# Altium project BALL-E-Main.PrjPCB
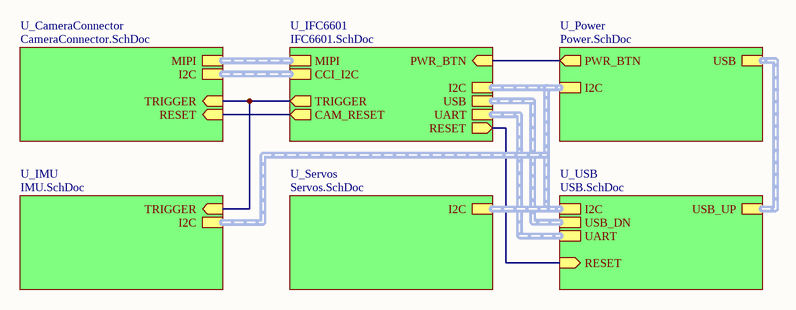
[diagram p0: BALL-E-Main.SchDoc]
7 sheets, 125 parts. Net scope: hierarchical (ports join the sheet entries above them; power ports are global).
Board file: BALL-E-Main.PcbDoc
Sheets:
  BALL-E-Main.SchDoc
    U_IFC6601 = IFC6601.SchDoc
    U_CameraConnector = CameraConnector.SchDoc
    U_IMU = IMU.SchDoc
    U_Power = Power.SchDoc
    U_Servos = Servos.SchDoc
    U_USB = USB.SchDoc

## Sheet BALL-E-Main.SchDoc
size A

### Sub-sheets
U_CameraConnector = CameraConnector.SchDoc: I2C (harness I2C), TRIGGER (in), RESET (in), MIPI (harness MIPI)
U_IFC6601 = IFC6601.SchDoc: PWR_BTN (in), UART (harness UART), USB (harness USB), I2C (harness I2C), CCI_I2C (harness I2C), RESET (out), CAM_RESET (out), TRIGGER (out), MIPI (harness MIPI)
U_IMU = IMU.SchDoc: I2C (harness I2C), TRIGGER (in)
U_Power = Power.SchDoc: I2C (harness I2C), USB (harness USB), PWR_BTN (out)
U_Servos = Servos.SchDoc: I2C (harness I2C)
U_USB = USB.SchDoc: RESET (in), USB_DN (harness USB), UART (harness UART), USB_UP (harness USB), I2C (harness I2C)

### Nets
RESET: sheet U_IFC6601/RESET, sheet U_USB/RESET
NetJP1_9: sheet U_IFC6601/TRIGGER, sheet U_CameraConnector/TRIGGER, sheet U_IMU/TRIGGER
NetJP1_10: sheet U_IFC6601/CAM_RESET, sheet U_CameraConnector/RESET
NetJP15_89: sheet U_IFC6601/PWR_BTN, sheet U_Power/PWR_BTN

### Buses and harness runs
harness sheet U_CameraConnector/I2C = sheet U_IFC6601/CCI_I2C
harness sheet U_CameraConnector/MIPI = sheet U_IFC6601/MIPI
harness sheet U_IFC6601/I2C = sheet U_IMU/I2C = sheet U_Power/I2C = sheet U_Servos/I2C = sheet U_USB/I2C
harness sheet U_IFC6601/UART = sheet U_USB/UART
harness sheet U_IFC6601/USB = sheet U_USB/USB_DN
harness sheet U_Power/USB = sheet U_USB/USB_UP

## Sheet IFC6601.SchDoc
size A
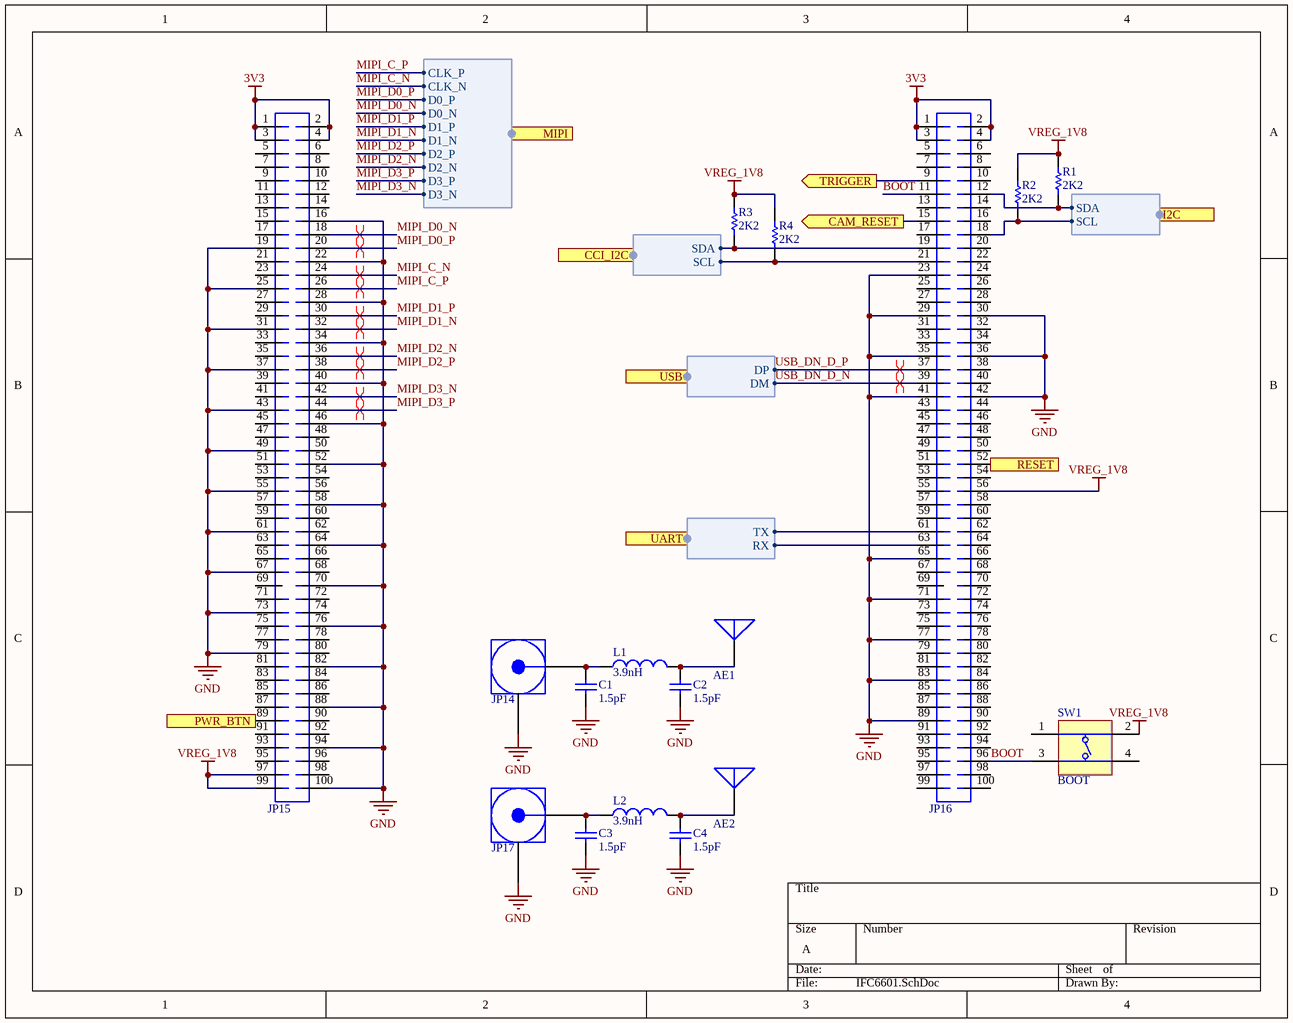
[diagram p1: IFC6601.SchDoc]

### Parts
(Parts that share a designator on the sheet are numbered #1, #2 ... from top to bottom, then left to right.)
AE1  2450AT42A100E  [ANTENNA (3.2x1.6MM)]  (value not drawn)
AE2  2450AT42A100E  [ANTENNA (3.2x1.6MM)]  (value not drawn)
C1  value 1.5pF  [C0402[1005X55]]  (hidden comment: 1.5pF 50V 0402)
C2  value 1.5pF  [C0402[1005X55]]  (hidden comment: 1.5pF 50V 0402)
C3  value 1.5pF  [C0402[1005X55]]  (hidden comment: 1.5pF 50V 0402)
C4  value 1.5pF  [C0402[1005X55]]  (hidden comment: 1.5pF 50V 0402)
JP14  MM4829-2702RB0  [COAX-HSC]  (value not drawn)
JP15  SAMTEC_SS4_100_RECEPTACLE  [SAMTEC-SS4-100-RECEPTACLE]  (value not drawn)
JP16  SAMTEC_SS4_100_RECEPTACLE  [SAMTEC-SS4-100-RECEPTACLE]  (value not drawn)
JP17  MM4829-2702RB0  [COAX-HSC]  (value not drawn)
L1  3.9nH  [IND0402]
L2  3.9nH  [IND0402]
R1  value 2K2  [R0402[1005]]  (hidden comment: 2K2 1% 0402)
R2  value 2K2  [R0402[1005]]  (hidden comment: 2K2 1% 0402)
R3  value 2K2  [R0402[1005]]  (hidden comment: 2K2 1% 0402)
R4  value 2K2  [R0402[1005]]  (hidden comment: 2K2 1% 0402)
SW1#1  BOOT  [SWITCH2]

### Ports
CAM_RESET (out), CCI_I2C (harness I2C), I2C (harness I2C), MIPI (harness MIPI), PWR_BTN (in), RESET (out), TRIGGER (out), UART (harness UART), USB (harness USB)

### Harnesses
UART: TX, RX
USB: DM, DP
I2C: SCL, SDA
MIPI: CLK_P, CLK_N, D0_P, D0_N, D1_P, D1_N, D2_P, D3_N, D2_N, D3_P

### Nets
3V3: JP15.1 JP15.2 JP15.3 JP15.4 JP16.1 JP16.2 JP16.3 JP16.4
GND: C1.1 C2.1 C3.1 C4.1 JP14.2 JP15.16 JP15.19 JP15.22 JP15.25 JP15.28 JP15.31 JP15.34 JP15.37 JP15.40 JP15.43 JP15.46 JP15.49 JP15.52 JP15.55 JP15.58 JP15.61 JP15.64 JP15.67 JP15.70 JP15.73 JP15.76 JP15.79 JP15.82 JP15.88 JP15.94 JP15.100 JP16.23 JP16.29 JP16.30 JP16.35 JP16.36 JP16.41 JP16.42 JP16.65 JP16.71 JP16.77 JP16.83 JP16.89 JP17.2
VREG_1V8: JP15.97 JP15.99 JP16.56 R1.2 R2.2 R3.2 R4.2 SW1#1.2(T2)
BOOT: JP16.11 JP16.96 SW1#1.3(T3)
I2C_SCL: JP16.18 R2.1 ; port I2C.SCL
I2C_SDA: JP16.12 R1.1 ; port I2C.SDA
MIPI_C_N: JP15.24 ; port MIPI.CLK_N
MIPI_C_P: JP15.26 ; port MIPI.CLK_P
MIPI_D0_N: JP15.18 ; port MIPI.D0_N
MIPI_D0_P: JP15.20 ; port MIPI.D0_P
MIPI_D1_N: JP15.32 ; port MIPI.D1_N
MIPI_D1_P: JP15.30 ; port MIPI.D1_P
MIPI_D2_N: JP15.36 ; port MIPI.D2_N
MIPI_D2_P: JP15.38 ; port MIPI.D2_P
MIPI_D3_N: JP15.42 ; port MIPI.D3_N
MIPI_D3_P: JP15.44 ; port MIPI.D3_P
RESET: JP16.52 ; port RESET
USB_DN_D_N: JP16.39 ; port USB.DM
USB_DN_D_P: JP16.37 ; port USB.DP
NetAE1_1: AE1.1 C2.2 L1.2
NetAE2_1: AE2.1 C4.2 L2.2
NetC1_2: C1.2 JP14.1 L1.1
NetC3_2: C3.2 JP17.1 L2.1
NetJP1_7: JP16.19 R3.1 ; port CCI_I2C.SDA
NetJP1_8: JP16.21 R4.1 ; port CCI_I2C.SCL
NetJP1_9: JP16.9 ; port TRIGGER
NetJP1_10: JP16.15 ; port CAM_RESET
NetJP15_89: JP15.89 ; port PWR_BTN
NetJP16_61: JP16.61 ; port UART.TX
NetJP16_63: JP16.63 ; port UART.RX

Not connected (* = marked no-connect by the designer): JP15 5(3) 6(4) 7(4) 8(5) 9(5) 10(6) 11(6) 12(7) 13(7) 14(8) 15(8) 17(9) 21(11) 23(12) 27(14) 29(15) 33(17) 35(18) 39(20) 41(21) 45(23) 47(24) 48(25) 50(26) 51(26) 53(27) 54(28) 56(29) 57(29) 59(30) 60(31) 62(32) 63(32) 65(33) 66(34) 68(35) 69(35) 71(36) 72(37) 74(38) 75(38) 77(39) 78(40) 80(41) 81(41) 83(42) 84(43) 85(43) 86(44) 87(44) 90(46) 91(46) 92(47) 93(47) 95(48) 96(49) 98(50); JP16 5(3) 6(4) 7(4) 8(5) 10(6) 13(7) 14(8) 16(9) 17(9) 20(11) 22(12) 24(13) 25(13) 26(14) 27(14) 28(15) 31(16) 32(17) 33(17) 34(18) 38(20) 40(21) 43(22) 44(23) 45(23) 46(24) 47(24) 48(25) 49(25) 50(26) 51(26) 53(27) 54(28) 55(28) 57(29) 58(30) 59(30) 60(31) 62(32) 64(33) 66(34) 67(34) 68(35) 69(35) 70(36) 72(37) 73(37) 74(38) 75(38) 76(39) 78(40) 79(40) 80(41) 81(41) 82(42) 84(43) 85(43) 86(44) 87(44) 88(45) 90(46) 91(46) 92(47) 93(47) 94(48) 95(48) 97(49) 98(50) 99(50) 100(51); SW1#1 1(T1) 4(T3)

### Layout directives
differential pair: MIPI_C_N, MIPI_C_P, MIPI_D0_N, MIPI_D0_P, MIPI_D1_N, MIPI_D1_P, MIPI_D2_N, MIPI_D2_P, MIPI_D3_N, MIPI_D3_P, USB_DN_D_N, USB_DN_D_P

### Library data of the parts
AE1 AE2 = 2450AT42A100E: Manufacturer: Johanson Technology Inc.; PartNumber: 2450AT42A100E; Mounting Technology: Surface Mount
C1-C4 = CAP_1.5pF_50V_0402_0.05pF: 1.5pF 50V 0.05pF 0402 (1005 Metric); PartNumber: GRM1555C1H1R5WA01D; Manufacturer: Murata; Mounting Technology: Surface Mount; PackageReference: 0402; PackageDescription: 0402 (1005 Metric); Voltage: 50V; Tolerance: 0.05pF
JP14 JP17 = MM4829-2702RB0: CONN HSC RCPT STR 50 OHM SMD; Manufacturer: Murata; PackageReference: HSC; PartNumber: MM4829-2702RB0; Mounting Technology: Surface Mount
JP15 JP16 = SAMTEC_SS4_100_RECEPTACLE: Manufacturer: Samtec; PartNumber: SS4-50-3.00-L-D-K-TR; PackageReference: SS4-100; Mounting Technology: Surface Mount
L1 L2 = IND_3.9nH_0.3A_0402_0.3nH: 3.9nH +/-0.3nH 0.3A 0402; PartNumber: LQG15HS3N9S02D; Manufacturer: Murata; PackageReference: 0402; PackageDescription: 0402 (2012 metric); Mounting Technology: Surface Mount; Current: 0.3A; Value: 3.9nH
R1-R4 = RES_2K2_0402_1%: 2K2 0.063W 1% 0402 (1005 Metric); Manufacturer: KOA Speer; PartNumber: RK73H1ETTP2201F; Tolerance: 1%; Power: 0.063W; Mounting Technology: Surface Mount; PackageReference: 0402; PackageDescription: 0402 (1005 Metric); ComponentLink1Description: Datasheet; ComponentLink1URL: http://www.koaspeer.com/catimages/Products/RK73H/RK73H.pdf
SW1#1 = DIPT-DTSM-6: Switch, SPNO Push Button SMD; Manufacturer: C&K Components; PartNumber: PTS810 SJM 250 SMTR LFS; Packing Type: Tape&Reel; Mechanical Life: 200,000 cycles; ComponentLink2URL: http://www.dip.com.tw/Products_tact.htm; ComponentLink1URL: http://www.dip.com.tw/; ComponentLink3URL: http://www.dip.com.tw/PDF/pro_tact/DTSM_G_-6_2_-V.pdf; PackageDescription: Switch, Surface Mount, 4 Leads, Body 4.6x2.8mm, Height 1.9mm; ComponentLink2Description: Datasheet; ComponentLink3Description: Package Specification; ComponentLink1Description: Manufacturer URL; PackageReference: PTS810; Mounting Technology: Surface Mount

## Sheet CameraConnector.SchDoc
size A
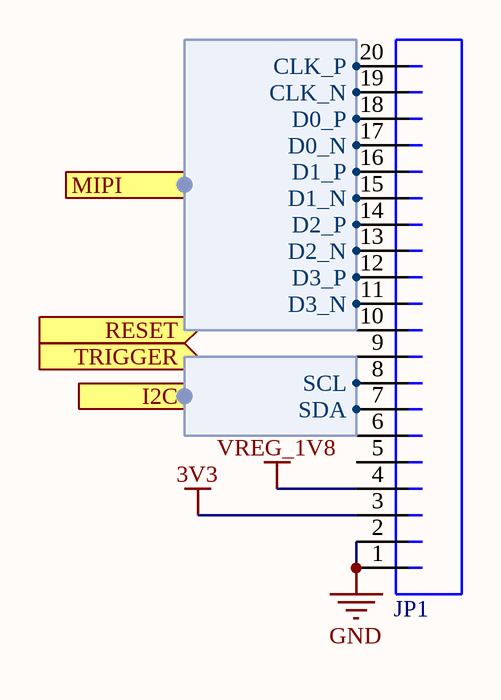
[diagram p2: CameraConnector.SchDoc]

### Parts
JP1  JST_JMD_20_HORZ  [JST-JMD-20-SMD-HORZ]  (value not drawn)

### Ports
I2C (harness I2C), MIPI (harness MIPI), RESET (in), TRIGGER (in)

### Harnesses
I2C: SCL, SDA
MIPI: CLK_P, CLK_N, D0_P, D0_N, D1_P, D1_N, D2_P, D3_N, D2_N, D3_P

### Nets
3V3: JP1.3
GND: JP1.1 JP1.2
VREG_1V8: JP1.4
MIPI_C_N: JP1.19 ; port MIPI.CLK_N
MIPI_C_P: JP1.20 ; port MIPI.CLK_P
MIPI_D0_N: JP1.17 ; port MIPI.D0_N
MIPI_D0_P: JP1.18 ; port MIPI.D0_P
MIPI_D1_N: JP1.15 ; port MIPI.D1_N
MIPI_D1_P: JP1.16 ; port MIPI.D1_P
MIPI_D2_N: JP1.13 ; port MIPI.D2_N
MIPI_D2_P: JP1.14 ; port MIPI.D2_P
MIPI_D3_N: JP1.11 ; port MIPI.D3_N
MIPI_D3_P: JP1.12 ; port MIPI.D3_P
NetJP1_7: JP1.7 ; port I2C.SDA
NetJP1_8: JP1.8 ; port I2C.SCL
NetJP1_9: JP1.9 ; port TRIGGER
NetJP1_10: JP1.10 ; port RESET

Not connected (* = marked no-connect by the designer): JP1 5 6

### Library data of the parts
JP1 = JST_JMD_20_HORZ: Manufacturer: JST Sales America, Inc.; PartNumber: 20PS-JMDSS-G-1-TF; PackageReference: JMD-20; Mounting Technology: Surface Mount

## Sheet IMU.SchDoc
size A
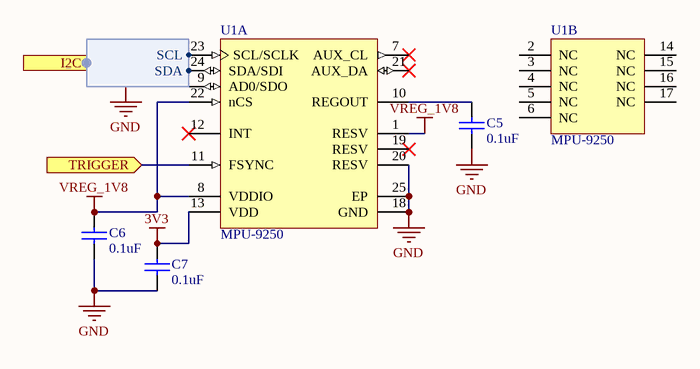
[diagram p3: IMU.SchDoc]

### Parts
C5  value 0.1uF  [C0402[1005X55]]  (hidden comment: 0.1uF 6.3V 0402)
C6  value 0.1uF  [C0402[1005X55]]  (hidden comment: 0.1uF 6.3V 0402)
C7  value 0.1uF  [C0402[1005X55]]  (hidden comment: 0.1uF 6.3V 0402)
U1  MPU-9250  [QFN-24 (0.4MM)]  (parts A,B of 2)

### Ports
I2C (harness I2C), TRIGGER (in)

### Harnesses
I2C: SCL, SDA

### Nets
3V3: C7.2 U1.13(VDD)
GND: C5.1 C6.1 C7.1 U1.9(AD0/SDO) U1.18(GND) U1.20(RESV) U1.25(EP)
VREG_1V8: C6.2 U1.1(RESV) U1.8(VDDIO) U1.22(nCS)
I2C_SCL: U1.23(SCL/SCLK) ; port I2C.SCL
I2C_SDA: U1.24(SDA/SDI) ; port I2C.SDA
NetC5_2: C5.2 U1.10(REGOUT)
NetJP1_9: U1.11(FSYNC) ; port TRIGGER

Not connected (* = marked no-connect by the designer): U1 2(NC) 3(NC) 4(NC) 5(NC) 6(NC) 7(AUX_CL)* 12(INT)* 14(NC) 15(NC) 16(NC) 17(NC) 19(RESV)* 21(AUX_DA)*

### Library data of the parts
C5-C7 = CAP_0.1uF_6.3V_0402_10%: 0.1uF 6.3V 10% 0402 (1005 Metric); PartNumber: GRM155R70J104KA01D; Manufacturer: Murata; Mounting Technology: Surface Mount; PackageReference: 0402; PackageDescription: 0402 (1005 Metric); Voltage: 6.3V; Tolerance: 10%
U1 = MPU-9250: Manufacturer: Invensense; PartNumber: MPU-9250; Mounting Technology: Surface Mount; PackageReference: QFN-24

## Sheet Power.SchDoc
size A
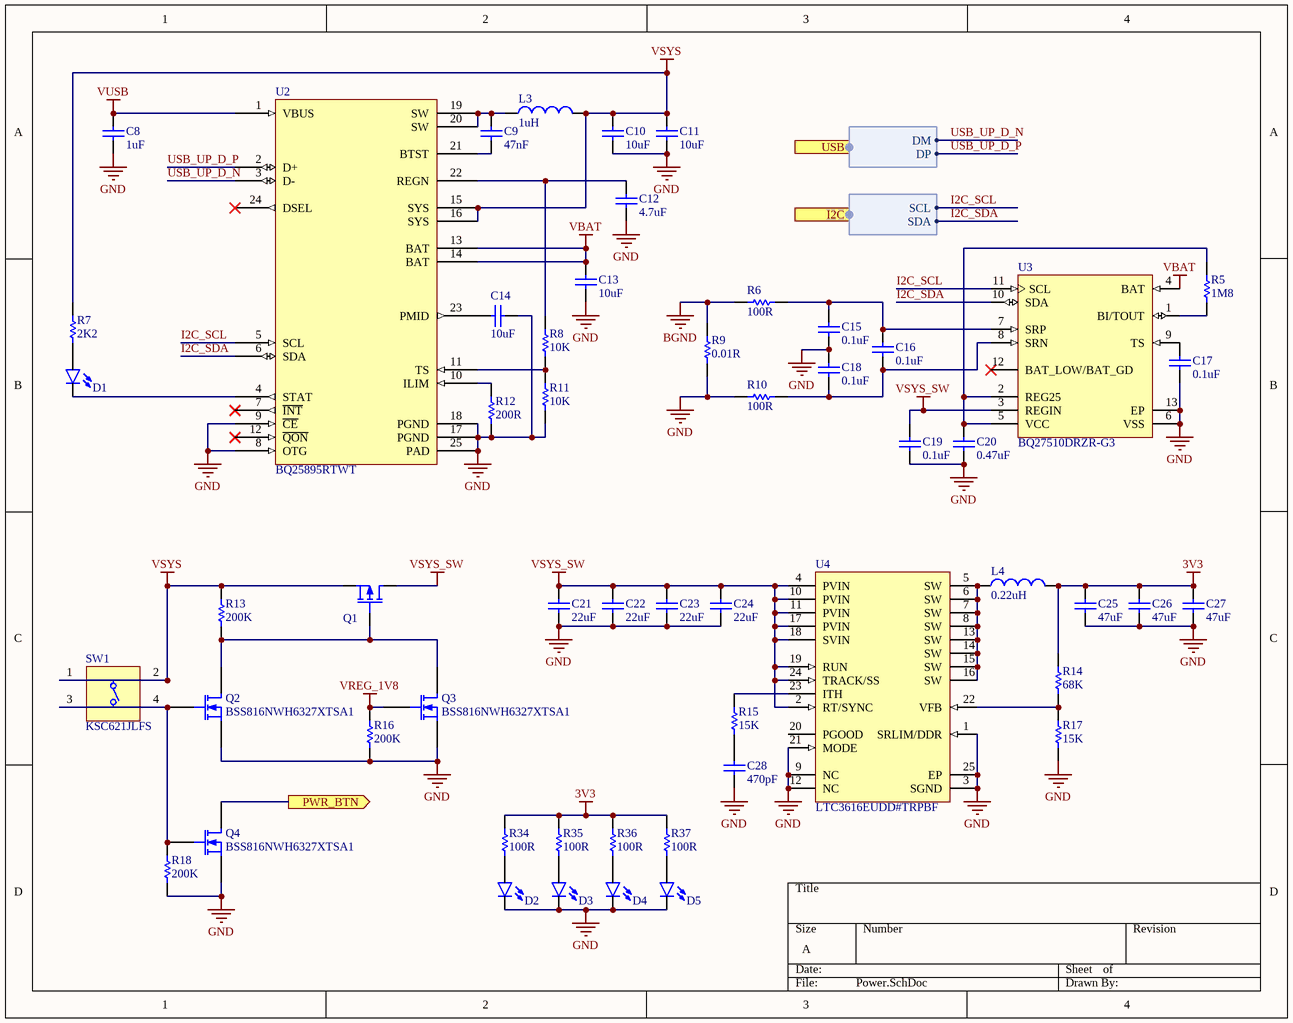
[diagram p4: Power.SchDoc]

### Parts
(Parts that share a designator on the sheet are numbered #1, #2 ... from top to bottom, then left to right.)
C8  value 1uF  [C0402[1005X55]]  (hidden comment: 1uF 16V 0402)
C9  value 47nF  [C0402[1005X55]]  (hidden comment: 47nF 16V 0402)
C10  value 10uF  [C0402[1005X55]]  (hidden comment: 10uF 6.3V 0402)
C11  value 10uF  [C0402[1005X55]]  (hidden comment: 10uF 6.3V 0402)
C12  value 4.7uF  [C0402[1005X55]]  (hidden comment: 4.7uF 10V 0402)
C13  value 10uF  [C0402[1005X55]]  (hidden comment: 10uF 6.3V 0402)
C14  value 10uF  [C0603[1608X92]]  (hidden comment: 10uF 35V 0603)
C15  value 0.1uF  [C0402[1005X55]]  (hidden comment: 0.1uF 6.3V 0402)
C16  value 0.1uF  [C0402[1005X55]]  (hidden comment: 0.1uF 6.3V 0402)
C17  value 0.1uF  [C0402[1005X55]]  (hidden comment: 0.1uF 6.3V 0402)
C18  value 0.1uF  [C0402[1005X55]]  (hidden comment: 0.1uF 6.3V 0402)
C19  value 0.1uF  [C0402[1005X55]]  (hidden comment: 0.1uF 6.3V 0402)
C20  value 0.47uF  [C0402[1005X55]]  (hidden comment: 0.47uF 25V 0402)
C21  value 22uF  [C0603[1608X92]]  (hidden comment: 22uF 6.3V 0603)
C22  value 22uF  [C0603[1608X92]]  (hidden comment: 22uF 6.3V 0603)
C23  value 22uF  [C0603[1608X92]]  (hidden comment: 22uF 6.3V 0603)
C24  value 22uF  [C0603[1608X92]]  (hidden comment: 22uF 6.3V 0603)
C25  value 47uF  [C1206[3216X160]]  (hidden comment: 47uF 6.3V 1206)
C26  value 47uF  [C1206[3216X160]]  (hidden comment: 47uF 6.3V 1206)
C27  value 47uF  [C1206[3216X160]]  (hidden comment: 47uF 6.3V 1206)
C28  value 470pF  [C0402[1005X55]]  (hidden comment: 470pF 50V 0402)
D1  LED_0603_GREEN_5mA  [LED0603]  (value not drawn)
D2  LED_0603_BLUE_5mA  [LED0603]  (value not drawn)
D3  LED_0603_BLUE_5mA  [LED0603]  (value not drawn)
D4  LED_0603_BLUE_5mA  [LED0603]  (value not drawn)
D5  LED_0603_BLUE_5mA  [LED0603]  (value not drawn)
L3  1uH  [IND1008]
L4  0.22uH  [IND1008]
Q1  SIS407DN-T1-GE3  [PowerPak-1212-8]  (value not drawn)
Q2  BSS816NWH6327XTSA1  [SOT323-3]
Q3  BSS816NWH6327XTSA1  [SOT323-3]
Q4  BSS816NWH6327XTSA1  [SOT323-3]
R5  value 1M8  [R0402[1005]]  (hidden comment: 1M8 1% 0402)
R6  value 100R  [R0402[1005]]  (hidden comment: 100R 1% 0402)
R7  value 2K2  [R0402[1005]]  (hidden comment: 2K2 1% 0402)
R8  value 10K  [R0402[1005]]  (hidden comment: 10K 1% 0402)
R9  value 0.01R  [R1206[3216]]  (hidden comment: 0.01R 1% 1206)
R10  value 100R  [R0402[1005]]  (hidden comment: 100R 1% 0402)
R11  value 10K  [R0402[1005]]  (hidden comment: 10K 1% 0402)
R12  value 200R  [R0402[1005]]  (hidden comment: 200R 1% 0402)
R13  value 200K  [R0402[1005]]  (hidden comment: 200K 1% 0402)
R14  value 68K  [R0402[1005]]  (hidden comment: 68K 1% 0402)
R15  value 15K  [R0402[1005]]  (hidden comment: 15K 1% 0402)
R16  value 200K  [R0402[1005]]  (hidden comment: 200K 1% 0402)
R17  value 15K  [R0402[1005]]  (hidden comment: 15K 1% 0402)
R18  value 200K  [R0402[1005]]  (hidden comment: 200K 1% 0402)
R34  value 100R  [R0402[1005]]  (hidden comment: 100R 1% 0402)
R35  value 100R  [R0402[1005]]  (hidden comment: 100R 1% 0402)
R36  value 100R  [R0402[1005]]  (hidden comment: 100R 1% 0402)
R37  value 100R  [R0402[1005]]  (hidden comment: 100R 1% 0402)
SW1#2  KSC621JLFS  [SWITCH]
U2  BQ25895RTWT  [WQFN-24]
U3  BQ27510DRZR-G3  [VSON-12]
U4  LTC3616EUDD#TRPBF  [LT-UDD-24_L]

### Ports
I2C (harness I2C), PWR_BTN (out), USB (harness USB)

### Harnesses
I2C: SCL, SDA
USB: DM, DP

### Nets
3V3: C25.2 C26.2 C27.2 L4.2 R14.2 R34.1 R35.1 R36.1 R37.1
BGND: R6.1 R9.2
GND: C8.1 C10.1 C11.1 C12.1 C13.1 C14.1 C15.1 C17.1 C18.2 C19.1 C20.1 C21.1 C22.1 C23.1 C24.1 C25.1 C26.1 C27.1 C28.1 D2.C D3.C D4.C D5.C Q2.2(S) Q3.2(S) Q4.2(S) R9.1 R10.1 R11.1 R12.1 R16.1 R17.1 R18.1 U2.8(OTG) U2.9(~{CE}) U2.17(PGND) U2.18(PGND) U2.25(PAD) U3.6(VSS) U3.13(EP) U4.1(SRLIM/DDR) U4.3(SGND) U4.9(NC) U4.12(NC) U4.21(MODE) U4.25(EP)
VBAT: C13.2 U2.13(BAT) U2.14(BAT) U3.4(BAT)
VREG_1V8: Q3.1(G) R16.2
VSYS: C10.2 C11.2 L3.2 Q1.1(S) R7.2 R13.2 SW1#2.1(T1) SW1#2.2(T2) U2.15(SYS) U2.16(SYS)
VSYS_SW: C19.2 C21.2 C22.2 C23.2 C24.2 Q1.3(D) U3.3(REGIN) U4.2(RT/SYNC) U4.4(PVIN) U4.10(PVIN) U4.11(PVIN) U4.17(PVIN) U4.18(SVIN) U4.19(RUN) U4.24(TRACK/SS)
VUSB: C8.2 U2.1(VBUS)
I2C_SCL: U2.5(SCL) U3.11(SCL) ; port I2C.SCL
I2C_SDA: U2.6(SDA) U3.10(SDA) ; port I2C.SDA
USB_UP_D_N: U2.3(D-) ; port USB.DM
USB_UP_D_P: U2.2(D+) ; port USB.DP
NetC9_1: C9.1 U2.21(BTST)
NetC9_2: C9.2 L3.1 U2.19(SW) U2.20(SW)
NetC12_2: C12.2 R8.2 U2.22(REGN)
NetC14_2: C14.2 U2.23(PMID)
NetC15_2: C15.2 C16.2 R6.2 U3.7(SRP)
NetC16_1: C16.1 C18.1 R10.2 U3.8(SRN)
NetC17_2: C17.2 U3.9(TS)
NetC20_2: C20.2 R5.2 U3.2(REG25) U3.5(VCC)
NetC28_2: C28.2 R15.1
NetD1_A: D1.A R7.1
NetD1_C: D1.C U2.4(STAT)
NetD2_A: D2.A R34.2
NetD3_A: D3.A R35.2
NetD4_A: D4.A R36.2
NetD5_A: D5.A R37.2
NetJP15_89: Q4.3(D) ; port PWR_BTN
NetL4_1: L4.1 U4.5(SW) U4.6(SW) U4.7(SW) U4.8(SW) U4.13(SW) U4.14(SW) U4.15(SW) U4.16(SW)
NetQ1_2: Q1.2(G) Q2.3(D) Q3.3(D) R13.1
NetQ2_1: Q2.1(G) Q4.1(G) R18.2 SW1#2.3(T3) SW1#2.4(T3)
NetR5_1: R5.1 U3.1(BI/TOUT)
NetR8_1: R8.1 R11.2 U2.11(TS)
NetR12_2: R12.2 U2.10(ILIM)
NetR14_1: R14.1 R17.2 U4.22(VFB)
NetR15_2: R15.2 U4.23(ITH)

Not connected (* = marked no-connect by the designer): U2 7(~{INT})* 12(~{QON})* 24(DSEL)*; U3 12(BAT_LOW/BAT_GD)*; U4 20(PGOOD)

### Library data of the parts
C8 = CAP_1uF_16V_0402_10%: 1uF 16V 10% 0402 (1005 Metric); PartNumber: GRM155R61C105KE01D; Manufacturer: Murata; Mounting Technology: Surface Mount; PackageReference: 0402; PackageDescription: 0402 (1005 Metric); Voltage: 16V; Tolerance: 10%
C9 = CAP_47nF_16V_0402_10%: 47nF 16V 10% 0402 (1005 Metric); PartNumber: GCM155R71C473KA37D; Manufacturer: Murata; Mounting Technology: Surface Mount; PackageReference: 0402; PackageDescription: 0402 (1005 Metric); Voltage: 16V; Tolerance: 10%
C10 C11 C13 = CAP_10uF_6.3V_0402_20%: 10uF 6.3V 20% 0402 (1005 Metric); PartNumber: GRM155R60J106ME44D; Manufacturer: Murata; Mounting Technology: Surface Mount; PackageReference: 0402; PackageDescription: 0402 (1005 Metric); Voltage: 6.3V; Tolerance: 20%
C12 = CAP_4.7uF_10V_0402_10%: 4.7uF 10V 10% 0402 (1005 Metric); PartNumber: ZRB15XR61A475KE01D; Manufacturer: Murata; Mounting Technology: Surface Mount; PackageReference: 0402; PackageDescription: 0402 (1005 Metric); Voltage: 10V; Tolerance: 10%
C14 = CAP_10uF_35V_0603_10%: 10uF 35V 10% 0603 (1608 Metric); PartNumber: GRM188R6YA106MA73D; Manufacturer: Murata; Mounting Technology: Surface Mount; PackageReference: 0603; PackageDescription: 0603 (1608 Metric); Voltage: 35V; Tolerance: 10%
C15-C19 = CAP_0.1uF_6.3V_0402_10%: as C5 on sheet IMU; Mounting Technology: Surface Mount; PackageReference: 0402; PackageDescription: 0402 (1005 Metric); Voltage: 6.3V; Tolerance: 10%
C20 = CAP_0.47uF_25V_0402_10%: 0.47uF 25V 10% 0402 (1005 Metric); PartNumber: GRM155R61E474KE01D; Manufacturer: Murata; Mounting Technology: Surface Mount; PackageReference: 0402; PackageDescription: 0402 (1005 Metric); Voltage: 25V; Tolerance: 10%
C21-C24 = CAP_22uF_6.3V_0603_10%: 22uF 6.3V 10% 0603 (1608 Metric); PartNumber: GRT188R60J226ME13D; Manufacturer: Murata; Mounting Technology: Surface Mount; PackageReference: 0603; PackageDescription: 0603 (1608 Metric); Voltage: 6.3V; Tolerance: 10%
C25-C27 = CAP_47uF_6.3V_1206_10%: 47uF 6.3V 10% 1206 (3216 Metric); PartNumber: GRM31CR60J476KE19L; Manufacturer: Murata; Mounting Technology: Surface Mount; PackageReference: 1206; PackageDescription: 1206 (3216 Metric); Voltage: 6.3V; Tolerance: 10%
C28 = CAP_470pF_50V_0402_5%: 470pF 50V 5% 0402 (1005 Metric); PartNumber: GCM1555C1H471JA16D; Manufacturer: Murata; Mounting Technology: Surface Mount; PackageReference: 0402; PackageDescription: 0402 (1005 Metric); Voltage: 50V; Tolerance: 5%
D1 = LED_0603_GREEN_5mA: PartNumber: LTST-C193TGKT-5A; Manufacturer: Lite-On Inc.; PackageReference: 0603; PackageDescription: 0603 (1608 Metric); Mounting Technology: Surface Mount
D2-D5 = LED_0603_BLUE_5mA: PartNumber: LTST-C193TBKT-5A; Manufacturer: Lite-On Inc.; PackageReference: 0603; PackageDescription: 0603 (1608 Metric); Mounting Technology: Surface Mount
L3 = IND_1uH_4.7A_1008_20%: 1uH 20% 4.7A 1008; PartNumber: DFE252012F-2R2M=P2; Manufacturer: Murata; PackageReference: 1008; PackageDescription: 1008 (2520 metric); Mounting Technology: Surface Mount; Current: 4.7A; Value: 1uH
L4 = IND_0.22uH_6.7A_1008_20%: 0.22uH 20% 6.7A 1008; PartNumber: TFM252012ALMAR22MTAA; Manufacturer: Murata; PackageReference: 1008; PackageDescription: 1008 (2520 metric); Mounting Technology: Surface Mount; Current: 6.7A; Value: 0.22uH
Q1 = SIS407DN-T1-GE3: P-Channel MOSFET; Manufacturer: Vishay; PartNumber: SIS407DN-T1-GE3; Mounting Technology: Surface Mount; PackageReference: PowerPAK-1212-8
Q2-Q4 = BSS816NWH6327XTSA1: N-Channel MOSFET; Manufacturer: Infineon Technologies; PartNumber: BSS816NWH6327XTSA1; PackageReference: SOT-323-3; Mounting Technology: Surface Mount
R5 = RES_1M8_0402_1%: 1M8 0.063W 1% 0402 (1005 Metric); Manufacturer: KOA Speer; PartNumber: RK73H1ETTP1804F; Tolerance: 1%; Power: 0.063W; Mounting Technology: Surface Mount; PackageReference: 0402; PackageDescription: 0402 (1005 Metric); ComponentLink1Description: Datasheet; ComponentLink1URL: http://www.koaspeer.com/catimages/Products/RK73H/RK73H.pdf
R6 R10 R34-R37 = RES_100R_0402_1%: 100R 0.063W 1% 0402 (1005 Metric); Manufacturer: KOA Speer; PartNumber: RK73H1ETTP1000F; Tolerance: 1%; Power: 0.063W; Mounting Technology: Surface Mount; PackageReference: 0402; PackageDescription: 0402 (1005 Metric); ComponentLink1Description: Datasheet; ComponentLink1URL: http://www.koaspeer.com/catimages/Products/RK73H/RK73H.pdf
R7 = RES_2K2_0402_1%: as R1 on sheet IFC6601; Tolerance: 1%; Power: 0.063W; Mounting Technology: Surface Mount; PackageReference: 0402; PackageDescription: 0402 (1005 Metric); ComponentLink1Description: Datasheet; ComponentLink1URL: http://www.koaspeer.com/catimages/Products/RK73H/RK73H.pdf
R8 R11 = RES_10K_0402_1%: 10K 0.063W 1% 0402 (1005 Metric); Manufacturer: KOA Speer; PartNumber: RK73H1ETTP1002F; Tolerance: 1%; Power: 0.063W; Mounting Technology: Surface Mount; PackageReference: 0402; PackageDescription: 0402 (1005 Metric); ComponentLink1Description: Datasheet; ComponentLink1URL: http://www.koaspeer.com/catimages/Products/RK73H/RK73H.pdf
R9 = RES_0.01R_1206_1%_1.5W: 0.01R 1.5W 1% 1206 (3216 Metric); Manufacturer: KOA Speer; PartNumber: TLR2BPDTD10L0F75; Tolerance: 1%; Power: 1.5W; Mounting Technology: Surface Mount; PackageReference: 1206; PackageDescription: 1206 (3216 Metric)
R12 = RES_200R_0402_1%: 200R 0.063W 1% 0402 (1005 Metric); Manufacturer: KOA Speer; PartNumber: RK73H1ETTP2000F; Tolerance: 1%; Power: 0.063W; Mounting Technology: Surface Mount; PackageReference: 0402; PackageDescription: 0402 (1005 Metric); ComponentLink1Description: Datasheet; ComponentLink1URL: http://www.koaspeer.com/catimages/Products/RK73H/RK73H.pdf
R13 R16 R18 = RES_200K_0402_1%: 200K 0.063W 1% 0402 (1005 Metric); Manufacturer: KOA Speer; PartNumber: RK73H1ETTP2003F; Tolerance: 1%; Power: 0.063W; Mounting Technology: Surface Mount; PackageReference: 0402; PackageDescription: 0402 (1005 Metric); ComponentLink1Description: Datasheet; ComponentLink1URL: http://www.koaspeer.com/catimages/Products/RK73H/RK73H.pdf
R14 = RES_68K_0402_1%: 68K 0.063W 1% 0402 (1005 Metric); Manufacturer: KOA Speer; PartNumber: RK73H1ETTP6802F; Tolerance: 1%; Power: 0.063W; Mounting Technology: Surface Mount; PackageReference: 0402; PackageDescription: 0402 (1005 Metric); ComponentLink1Description: Datasheet; ComponentLink1URL: http://www.koaspeer.com/catimages/Products/RK73H/RK73H.pdf
R15 R17 = RES_15K_0402_1%: 15K 0.063W 1% 0402 (1005 Metric); Manufacturer: KOA Speer; PartNumber: RK73H1ETTP1502F; Tolerance: 1%; Power: 0.063W; Mounting Technology: Surface Mount; PackageReference: 0402; PackageDescription: 0402 (1005 Metric); ComponentLink1Description: Datasheet; ComponentLink1URL: http://www.koaspeer.com/catimages/Products/RK73H/RK73H.pdf
SW1#2 = KSC621JLFS: Switch, SPNO Push Button SMD; Manufacturer: C&K Components; Packing Type: Tape&Reel; Mechanical Life: 200,000 cycles; ComponentLink2URL: http://www.dip.com.tw/Products_tact.htm; ComponentLink1URL: http://www.dip.com.tw/; ComponentLink3URL: http://www.dip.com.tw/PDF/pro_tact/DTSM_G_-6_2_-V.pdf; PackageDescription: Switch, Surface Mount, 4 Leads, Body 6.2x6.2mm, Height 7.7mm; ComponentLink2Description: Datasheet; ComponentLink3Description: Package Specification; ComponentLink1Description: Manufacturer URL; PackageReference: KSC; PartNumber: KSC621JLFS; Mounting Technology: Surface Mount
U2 = BQ25895RTWT: IC NVDC CHARGER I2C 24WQFN; Manufacturer: Texas Instruments; PartNumber: BQ25895RTWT; PackageReference: WQFN-24; Mounting Technology: Surface Mount
U3 = BQ27510DRZR-G3: Battery Management System-Side Impedance Track Fuel Gauge; Manufacturer: Texas Instruments; PartNumber: BQ27510DRZR-G3; PackageReference: VSON-12; Mounting Technology: Surface Mount
U4 = CMP-0492-02186-1: 6 A, 4 MHz Monolithic Synchronous Step-Down DC/DC Converter, 24-pin QFN (UDD-24), -40 to 125 degC, Pb-Free, Tape and Reel; Manufacturer: Linear Technology; Frequency Adjust Range: Up - 4MHz; Number of Outputs: 1; ComponentLink3URL: http://cds.linear.com/docs/en/packaging/(UDD24)%20QFN%2005-08-1833%20Rev%20%C3%98.pdf; PartNumber: LTC3616EUDD#TRPBF; Packing: Tape and Reel; ComponentLink1URL: http://www.linear.com/; ComponentLink2URL: http://cds.linear.com/docs/en/datasheet/3616fa.pdf; Mounting Technology: Surface Mount; ComponentLink3Description: Package Specification; PackageVersion: Rev. Ã˜, 05/2011; ComponentLink1Description: Manufacturer URL; DatasheetVersion: Rev. A; ComponentLink2Description: Datasheet; RoHS: TRUE; PackageReference: UDD-24; PackageDescription: 24-Pin Plastic QFN, Body 5 x 3 mm, Pitch 0.5 mm

## Sheet Servos.SchDoc
size A
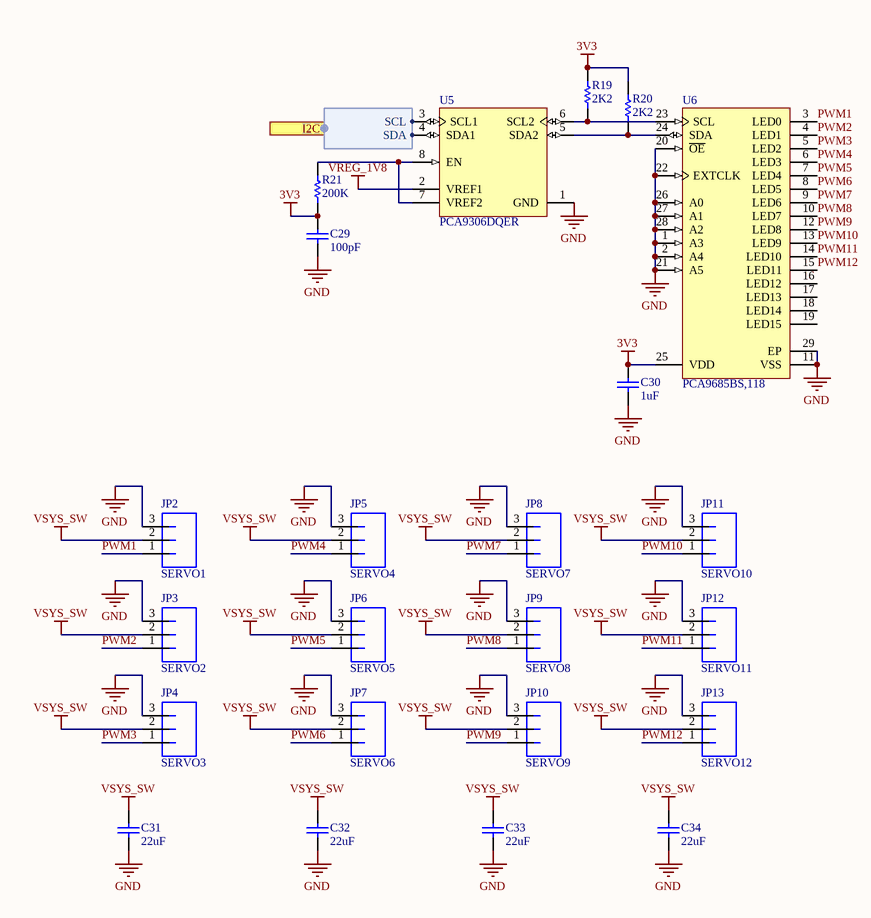
[diagram p5: Servos.SchDoc]

### Parts
C29  value 100pF  [C0402[1005X55]]  (hidden comment: 100pF 100V 0402)
C30  value 1uF  [C0402[1005X55]]  (hidden comment: 1uF 6.3V 0402)
C31  value 22uF  [C0603[1608X92]]  (hidden comment: 22uF 6.3V 0603)
C32  value 22uF  [C0603[1608X92]]  (hidden comment: 22uF 6.3V 0603)
C33  value 22uF  [C0603[1608X92]]  (hidden comment: 22uF 6.3V 0603)
C34  value 22uF  [C0603[1608X92]]  (hidden comment: 22uF 6.3V 0603)
JP2  SERVO1  [MOLEX-PICOBLADE-1.25MM-3-VERT-SMD]
JP3  SERVO2  [MOLEX-PICOBLADE-1.25MM-3-VERT-SMD]
JP4  SERVO3  [MOLEX-PICOBLADE-1.25MM-3-VERT-SMD]
JP5  SERVO4  [MOLEX-PICOBLADE-1.25MM-3-VERT-SMD]
JP6  SERVO5  [MOLEX-PICOBLADE-1.25MM-3-VERT-SMD]
JP7  SERVO6  [MOLEX-PICOBLADE-1.25MM-3-VERT-SMD]
JP8  SERVO7  [MOLEX-PICOBLADE-1.25MM-3-VERT-SMD]
JP9  SERVO8  [MOLEX-PICOBLADE-1.25MM-3-VERT-SMD]
JP10  SERVO9  [MOLEX-PICOBLADE-1.25MM-3-VERT-SMD]
JP11  SERVO10  [MOLEX-PICOBLADE-1.25MM-3-VERT-SMD]
JP12  SERVO11  [MOLEX-PICOBLADE-1.25MM-3-VERT-SMD]
JP13  SERVO12  [MOLEX-PICOBLADE-1.25MM-3-VERT-SMD]
R19  value 2K2  [R0402[1005]]  (hidden comment: 2K2 1% 0402)
R20  value 2K2  [R0402[1005]]  (hidden comment: 2K2 1% 0402)
R21  value 200K  [R0402[1005]]  (hidden comment: 200K 1% 0402)
U5  PCA9306DQER  [DQE0008A_V]
U6  PCA9685BS,118  [VQFN-28]

### Ports
I2C (harness I2C)

### Harnesses
I2C: SCL, SDA

### Nets
3V3: C29.2 C30.2 R19.2 R20.2 R21.1 U6.25(VDD)
GND: C29.1 C30.1 C31.1 C32.1 C33.1 C34.1 JP2.3 JP3.3 JP4.3 JP5.3 JP6.3 JP7.3 JP8.3 JP9.3 JP10.3 JP11.3 JP12.3 JP13.3 U5.1(GND) U6.1(A3) U6.2(A4) U6.11(VSS) U6.20(~{OE}) U6.21(A5) U6.22(EXTCLK) U6.26(A0) U6.27(A1) U6.28(A2) U6.29(EP)
VREG_1V8: U5.2(VREF1)
VSYS_SW: C31.2 C32.2 C33.2 C34.2 JP2.2 JP3.2 JP4.2 JP5.2 JP6.2 JP7.2 JP8.2 JP9.2 JP10.2 JP11.2 JP12.2 JP13.2
I2C_SCL: U5.3(SCL1) ; port I2C.SCL
I2C_SDA: U5.4(SDA1) ; port I2C.SDA
PWM1: JP2.1 U6.3(LED0)
PWM2: JP3.1 U6.4(LED1)
PWM3: JP4.1 U6.5(LED2)
PWM4: JP5.1 U6.6(LED3)
PWM5: JP6.1 U6.7(LED4)
PWM6: JP7.1 U6.8(LED5)
PWM7: JP8.1 U6.9(LED6)
PWM8: JP9.1 U6.10(LED7)
PWM9: JP10.1 U6.12(LED8)
PWM10: JP11.1 U6.13(LED9)
PWM11: JP12.1 U6.14(LED10)
PWM12: JP13.1 U6.15(LED11)
NetR19_1: R19.1 U5.6(SCL2) U6.23(SCL)
NetR20_1: R20.1 U5.5(SDA2) U6.24(SDA)
NetR21_2: R21.2 U5.7(VREF2) U5.8(EN)

Not connected (* = marked no-connect by the designer): U6 16(LED12) 17(LED13) 18(LED14) 19(LED15)

### Library data of the parts
C29 = CAP_100pF_100V_0402_5%: 100pF 100V 5% 0402 (1005 Metric); PartNumber: GRM1555C2A101JA01D; Manufacturer: Murata; Mounting Technology: Surface Mount; PackageReference: 0402; PackageDescription: 0402 (1005 Metric); Voltage: 100V; Tolerance: 5%
C30 = CAP_1uF_6.3V_0402_10%: 1uF 6.3V 10% 0402 (1005 Metric); PartNumber: GRM155R70J105KA12D; Manufacturer: Murata; Mounting Technology: Surface Mount; PackageReference: 0402; PackageDescription: 0402 (1005 Metric); Voltage: 6.3V; Tolerance: 10%
C31-C34 = CAP_22uF_6.3V_0603_10%: as C21 on sheet Power; Mounting Technology: Surface Mount; PackageReference: 0603; PackageDescription: 0603 (1608 Metric); Voltage: 6.3V; Tolerance: 10%
JP2-JP13 = MOLEX_PICOBLADE_1.25MM_3_VERT_SMD: Manufacturer: Molex; PartNumber: 0533980371; Mounting Technology: Surface Mount; PackageReference: PicoBlade-1.25mm
R19 R20 = RES_2K2_0402_1%: as R1 on sheet IFC6601; Tolerance: 1%; Power: 0.063W; Mounting Technology: Surface Mount; PackageReference: 0402; PackageDescription: 0402 (1005 Metric); ComponentLink1Description: Datasheet; ComponentLink1URL: http://www.koaspeer.com/catimages/Products/RK73H/RK73H.pdf
R21 = RES_200K_0402_1%: as R13 on sheet Power; Tolerance: 1%; Power: 0.063W; Mounting Technology: Surface Mount; PackageReference: 0402; PackageDescription: 0402 (1005 Metric); ComponentLink1Description: Datasheet; ComponentLink1URL: http://www.koaspeer.com/catimages/Products/RK73H/RK73H.pdf
U5 = CMP-0314-00177-2: Dual Bi-Directional I2C-Bus and SMBus Voltage Level-Translator, 0 to 5.5 V, -40 to 85 degC, 8-pin X2SON (DQE), Green (RoHS & no Sb/Br); Manufacturer: Texas Instruments; Max Frequency(kHz): 400; tpd max(ns): 1.5; SubFamily: I2C Special Function; Open Drain I/O Type: Yes; Vcc range(V): 0 to 5.5; No. of Outputs: 2; Function: Voltage Translator; Rating: Catalog; PackageVersion: revB, Oct-2008; Eco-Plan: Green (RoHS & no Sb/Br); Mounting Technology: Surface Mount; PackageReference: DQE0008A; ComponentLink1Description: Datasheet; DatasheetVersion: SCPS113J; PartNumber: PCA9306DQER; ComponentLink2Description: Package Specification; fSCLK(Max)(MHz): 400; On-Chip Power-on-Reset: No; Enable Pin: Yes; Code_JEDEC: MO-287-X2EAF; 5V Tolerant I/O: Yes; PackageDescription: 8-Pin Plastic Small Outline No-Lead, 1.4 x 1 x 0.4 mm Body, 0.35 mm Pitch; ComponentLink2URL: http://www.ti.com/litv/pdf/mpds049b; ComponentLink1URL: http://www.ti.com/general/docs/lit/getliterature.tsp?genericPartNumber=PCA9306&fileType=pdf
U6 = PCA9685BS,118: IC LED DRVR LIN DIM 25MA 28HVQFN; Manufacturer: NXP; PartNumber: PCA9685BS,118; PackageReference: QFN-28; Mounting Technology: Surface Mount

## Sheet USB.SchDoc
size A
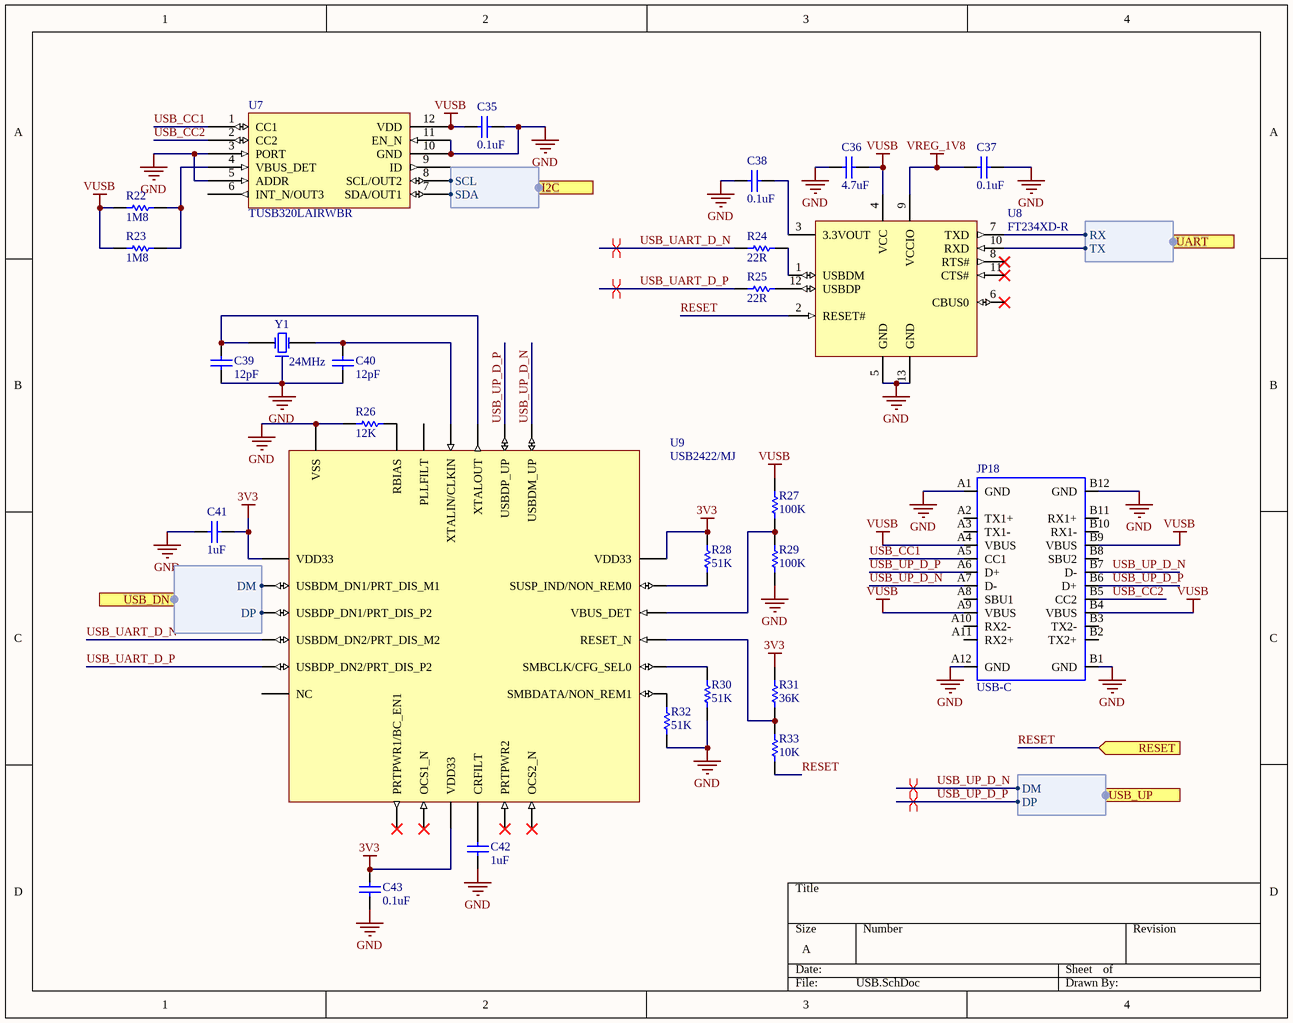
[diagram p6: USB.SchDoc]

### Parts
C35  value 0.1uF  [C0402[1005X55]]  (hidden comment: 0.1uF 6.3V 0402)
C36  value 4.7uF  [C0402[1005X55]]  (hidden comment: 4.7uF 6.3V 0402)
C37  value 0.1uF  [C0402[1005X55]]  (hidden comment: 0.1uF 6.3V 0402)
C38  value 0.1uF  [C0402[1005X55]]  (hidden comment: 0.1uF 6.3V 0402)
C39  value 12pF  [C0402[1005X55]]  (hidden comment: 12pF 50V 0402)
C40  value 12pF  [C0402[1005X55]]  (hidden comment: 12pF 50V 0402)
C41  value 1uF  [C0402[1005X55]]  (hidden comment: 1uF 6.3V 0402)
C42  value 1uF  [C0402[1005X55]]  (hidden comment: 1uF 6.3V 0402)
C43  value 0.1uF  [C0402[1005X55]]  (hidden comment: 0.1uF 6.3V 0402)
JP18  USB-C  [USB-C-3.1]
R22  value 1M8  [R0402[1005]]  (hidden comment: 1M8 1% 0402)
R23  value 1M8  [R0402[1005]]  (hidden comment: 1M8 1% 0402)
R24  value 22R  [R0402[1005]]  (hidden comment: 22R 1% 0402)
R25  value 22R  [R0402[1005]]  (hidden comment: 22R 1% 0402)
R26  value 12K  [R0402[1005]]  (hidden comment: 12K 1% 0402)
R27  value 100K  [R0402[1005]]  (hidden comment: 100K 1% 0402)
R28  value 51K  [R0402[1005]]  (hidden comment: 51K 1% 0402)
R29  value 100K  [R0402[1005]]  (hidden comment: 100K 1% 0402)
R30  value 51K  [R0402[1005]]  (hidden comment: 51K 1% 0402)
R31  value 36K  [R0402[1005]]  (hidden comment: 36K 1% 0402)
R32  value 51K  [R0402[1005]]  (hidden comment: 51K 1% 0402)
R33  value 10K  [R0402[1005]]  (hidden comment: 10K 1% 0402)
U7  TUSB320LAIRWBR  [X2QFN-12]
U8  FT234XD-R  [DFN-12]
U9  USB2422/MJ  [QFN-24 (4x4MM)]
Y1  24MHz  [CRYSTAL_2.0x1.6]

### Ports
I2C (harness I2C), RESET (in), UART (harness UART), USB_DN (harness USB), USB_UP (harness USB)

### Harnesses
USB: DM, DP
UART: TX, RX
I2C: SCL, SDA

### Nets
3V3: C41.2 C43.2 R28.2 R31.2 U9.1(VDD33) U9.9(VDD33) U9.18(VDD33)
GND: C35.1 C36.2 C37.1 C38.2 C39.1 C40.1 C41.1 C42.1 C43.1 JP18.A1(GND) JP18.A12(GND) JP18.B1(GND) JP18.B12(GND) R26.1 R29.1 R30.1 R32.1 U7.3(PORT) U7.5(ADDR) U7.10(GND) U7.11(EN_N) U8.5(GND) U8.13(GND) U9.25(VSS) Y1.2
VREG_1V8: C37.2 U8.9(VCCIO)
VUSB: C35.2 C36.1 JP18.A4(VBUS) JP18.A9(VBUS) JP18.B4(VBUS) JP18.B9(VBUS) R22.1 R23.1 R27.2 U7.12(VDD) U8.4(VCC)
I2C_SCL: U7.8(SCL/OUT2) ; port I2C.SCL
I2C_SDA: U7.7(SDA/OUT1) ; port I2C.SDA
RESET: R33.1 U8.2(RESET#) ; port RESET
USB_CC1: JP18.A5(CC1) U7.1(CC1)
USB_CC2: JP18.B5(CC2) U7.2(CC2)
USB_DN_D_N: U9.2(USBDM_DN1/PRT_DIS_M1) ; port USB_DN.DM
USB_DN_D_P: U9.3(USBDP_DN1/PRT_DIS_P2) ; port USB_DN.DP
USB_UART_D_N: R24.1 U9.4(USBDM_DN2/PRT_DIS_M2)
USB_UART_D_P: R25.1 U9.5(USBDP_DN2/PRT_DIS_P2)
USB_UP_D_N: JP18.A7(D-) JP18.B7(D-) U9.19(USBDM_UP) ; port USB_UP.DM
USB_UP_D_P: JP18.A6(D+) JP18.B6(D+) U9.20(USBDP_UP) ; port USB_UP.DP
NetC38_1: C38.1 U8.3(3.3VOUT)
NetC39_2: C39.2 U9.21(XTALOUT) Y1.1(X1)
NetC40_2: C40.2 U9.22(XTALIN/CLKIN) Y1.3(X2)
NetC42_2: C42.2 U9.10(CRFILT)
NetJP16_61: U8.10(RXD) ; port UART.TX
NetJP16_63: U8.7(TXD) ; port UART.RX
NetR22_2: R22.2 R23.2 U7.4(VBUS_DET)
NetR24_2: R24.2 U8.1(USBDM)
NetR25_2: R25.2 U8.12(USBDP)
NetR26_2: R26.2 U9.24(RBIAS)
NetR27_1: R27.1 R29.2 U9.16(VBUS_DET)
NetR28_1: R28.1 U9.17(SUSP_IND/NON_REM0)
NetR30_2: R30.2 U9.14(SMBCLK/CFG_SEL0)
NetR31_1: R31.1 R33.2 U9.15(RESET_N)
NetR32_2: R32.2 U9.13(SMBDATA/NON_REM1)

Not connected (* = marked no-connect by the designer): JP18 A2(TX1+) A3(TX1-) A8(SBU1) A10(RX2-) A11(RX2+) B2(TX2+) B3(TX2-) B8(SBU2) B10(RX1-) B11(RX1+); U7 6(INT_N/OUT3) 9(ID); U8 6(CBUS0)* 8(RTS#)* 11(CTS#)*; U9 6(NC) 7(PRTPWR1/BC_EN1)* 8(OCS1_N)* 11(PRTPWR2)* 12(OCS2_N)* 23(PLLFILT)

### Layout directives
differential pair: USB_UART_D_N, USB_UART_D_P, USB_UP_D_N, USB_UP_D_P

### Library data of the parts
C35 C37 C38 C43 = CAP_0.1uF_6.3V_0402_10%: as C5 on sheet IMU; Mounting Technology: Surface Mount; PackageReference: 0402; PackageDescription: 0402 (1005 Metric); Voltage: 6.3V; Tolerance: 10%
C36 = CAP_4.7uF_6.3V_0402_20%: 4.7uF 6.3V 20% 0402 (1005 Metric); PartNumber: GRM155R60J475ME47D; Manufacturer: Murata; Mounting Technology: Surface Mount; PackageReference: 0402; PackageDescription: 0402 (1005 Metric); Voltage: 6.3V; Tolerance: 20%
C39 C40 = CAP_12pF_50V_0402_5%: 12pF 50V 5% 0402 (1005 Metric); PartNumber: GRM1555C1H120JA01D; Manufacturer: Murata; Mounting Technology: Surface Mount; PackageReference: 0402; PackageDescription: 0402 (1005 Metric); Voltage: 50V; Tolerance: 5%
C41 C42 = CAP_1uF_6.3V_0402_10%: as C30 on sheet Servos; Mounting Technology: Surface Mount; PackageReference: 0402; PackageDescription: 0402 (1005 Metric); Voltage: 6.3V; Tolerance: 10%
JP18 = USB_C_3.1_SMT: PartNumber: 12401610E4#2A; Manufacturer: Amphenol FCI; Mounting Technology: Surface Mount; PackageReference: USB 3.1 - Type C
R22 R23 = RES_1M8_0402_1%: as R5 on sheet Power; Tolerance: 1%; Power: 0.063W; Mounting Technology: Surface Mount; PackageReference: 0402; PackageDescription: 0402 (1005 Metric); ComponentLink1Description: Datasheet; ComponentLink1URL: http://www.koaspeer.com/catimages/Products/RK73H/RK73H.pdf
R24 R25 = RES_22R_0402_1%: 22R 0.063W 1% 0402 (1005 Metric); Manufacturer: KOA Speer; PartNumber: RK73H1ETTP22R0F; Tolerance: 1%; Power: 0.063W; Mounting Technology: Surface Mount; PackageReference: 0402; PackageDescription: 0402 (1005 Metric); ComponentLink1Description: Datasheet; ComponentLink1URL: http://www.koaspeer.com/catimages/Products/RK73H/RK73H.pdf
R26 = RES_12K_0402_1%: 12K 0.063W 1% 0402 (1005 Metric); Manufacturer: KOA Speer; PartNumber: RK73H1ETTP1202F; Tolerance: 1%; Power: 0.063W; Mounting Technology: Surface Mount; PackageReference: 0402; PackageDescription: 0402 (1005 Metric); ComponentLink1Description: Datasheet; ComponentLink1URL: http://www.koaspeer.com/catimages/Products/RK73H/RK73H.pdf
R27 R29 = RES_100K_0402_1%: 100K 0.063W 1% 0402 (1005 Metric); Manufacturer: KOA Speer; PartNumber: RK73H1ETTP1003F; Tolerance: 1%; Power: 0.063W; Mounting Technology: Surface Mount; PackageReference: 0402; PackageDescription: 0402 (1005 Metric); ComponentLink1Description: Datasheet; ComponentLink1URL: http://www.koaspeer.com/catimages/Products/RK73H/RK73H.pdf
R28 R30 R32 = RES_51K_0402_1%: 51K 0.063W 1% 0402 (1005 Metric); Manufacturer: KOA Speer; PartNumber: RK73H1ETTP5102F; Tolerance: 1%; Power: 0.063W; Mounting Technology: Surface Mount; PackageReference: 0402; PackageDescription: 0402 (1005 Metric); ComponentLink1Description: Datasheet; ComponentLink1URL: http://www.koaspeer.com/catimages/Products/RK73H/RK73H.pdf
R31 = RES_36K_0402_1%: 36K 0.063W 1% 0402 (1005 Metric); Manufacturer: KOA Speer; PartNumber: RK73H1ETTP3602F; Tolerance: 1%; Power: 0.063W; Mounting Technology: Surface Mount; PackageReference: 0402; PackageDescription: 0402 (1005 Metric); ComponentLink1Description: Datasheet; ComponentLink1URL: http://www.koaspeer.com/catimages/Products/RK73H/RK73H.pdf
R33 = RES_10K_0402_1%: as R8 on sheet Power; Tolerance: 1%; Power: 0.063W; Mounting Technology: Surface Mount; PackageReference: 0402; PackageDescription: 0402 (1005 Metric); ComponentLink1Description: Datasheet; ComponentLink1URL: http://www.koaspeer.com/catimages/Products/RK73H/RK73H.pdf
U7 = TUSB320LAIRWBR: USB Interface IC Type-C Configuration Channel Logic and Port Control 12-X2QFN -40 to 85; Manufacturer: Texas Instruments; PackageReference: QFN-12; Mounting Technology: Surface Mount; PartNumber: TUSB320LAIRWBR
U8 = FT234XD-R: USB Interface IC USB to Serial UART Interface; Manufacturer: FTDI; PartNumber: FT234XD-R; PackageReference: DFN-12; Mounting Technology: Surface Mount
U9 = USB2422/MJ: USB Hub IC 2-Port; Manufacturer: Microchip; PartNumber: USB2422/MJ; PackageReference: QFN-24; Mounting Technology: Surface Mount
Y1 = FA-128 24.0000MF10Z-W3: Manufacturer: EPSON; PartNumber: FA-128 24.0000MF10Z-W3; Mounting Technology: Surface Mount; PackageReference: 4-SMD

## Nets that join several sheets
3V3: IFC6601 (8 pins), CameraConnector (JP1.3), IMU (C7.2 U1.13), Power (9 pins), Servos (6 pins), USB (7 pins)
GND: IFC6601 (44 pins), CameraConnector (JP1.1 JP1.2), IMU (7 pins), Power (46 pins), Servos (29 pins), USB (25 pins)
VREG_1V8: IFC6601 (8 pins), CameraConnector (JP1.4), IMU (C6.2 U1.1 U1.8 U1.22), Power (Q3.1 R16.2), Servos (U5.2), USB (C37.2 U8.9)
VSYS_SW: Power (15 pins), Servos (16 pins)
VUSB: Power (C8.2 U2.1), USB (11 pins)
I2C_SCL: IFC6601 (JP16.18 R2.1), IMU (U1.23), Power (U2.5 U3.11), Servos (U5.3), USB (U7.8)
I2C_SDA: IFC6601 (JP16.12 R1.1), IMU (U1.24), Power (U2.6 U3.10), Servos (U5.4), USB (U7.7)
MIPI_C_N: IFC6601 (JP15.24), CameraConnector (JP1.19)
MIPI_C_P: IFC6601 (JP15.26), CameraConnector (JP1.20)
MIPI_D0_N: IFC6601 (JP15.18), CameraConnector (JP1.17)
MIPI_D0_P: IFC6601 (JP15.20), CameraConnector (JP1.18)
MIPI_D1_N: IFC6601 (JP15.32), CameraConnector (JP1.15)
MIPI_D1_P: IFC6601 (JP15.30), CameraConnector (JP1.16)
MIPI_D2_N: IFC6601 (JP15.36), CameraConnector (JP1.13)
MIPI_D2_P: IFC6601 (JP15.38), CameraConnector (JP1.14)
MIPI_D3_N: IFC6601 (JP15.42), CameraConnector (JP1.11)
MIPI_D3_P: IFC6601 (JP15.44), CameraConnector (JP1.12)
NetJP1_7: IFC6601 (JP16.19 R3.1), CameraConnector (JP1.7)
NetJP1_8: IFC6601 (JP16.21 R4.1), CameraConnector (JP1.8)
NetJP1_9: IFC6601 (JP16.9), CameraConnector (JP1.9), IMU (U1.11)
NetJP1_10: IFC6601 (JP16.15), CameraConnector (JP1.10)
NetJP15_89: IFC6601 (JP15.89), Power (Q4.3)
NetJP16_61: IFC6601 (JP16.61), USB (U8.10)
NetJP16_63: IFC6601 (JP16.63), USB (U8.7)
RESET: IFC6601 (JP16.52), USB (R33.1 U8.2)
USB_DN_D_N: IFC6601 (JP16.39), USB (U9.2)
USB_DN_D_P: IFC6601 (JP16.37), USB (U9.3)
USB_UP_D_N: Power (U2.3), USB (JP18.A7 JP18.B7 U9.19)
USB_UP_D_P: Power (U2.2), USB (JP18.A6 JP18.B6 U9.20)